# Altium schematic sheet 7-RES_CHECK.SchDoc: RD15002_SingleSCT.PrjPcb
size A4; DrawnBy: 邓勇杰; Revision: A1.0.0; SheetNumber: 8; SheetTotal: 10; Time: 2015/12/2
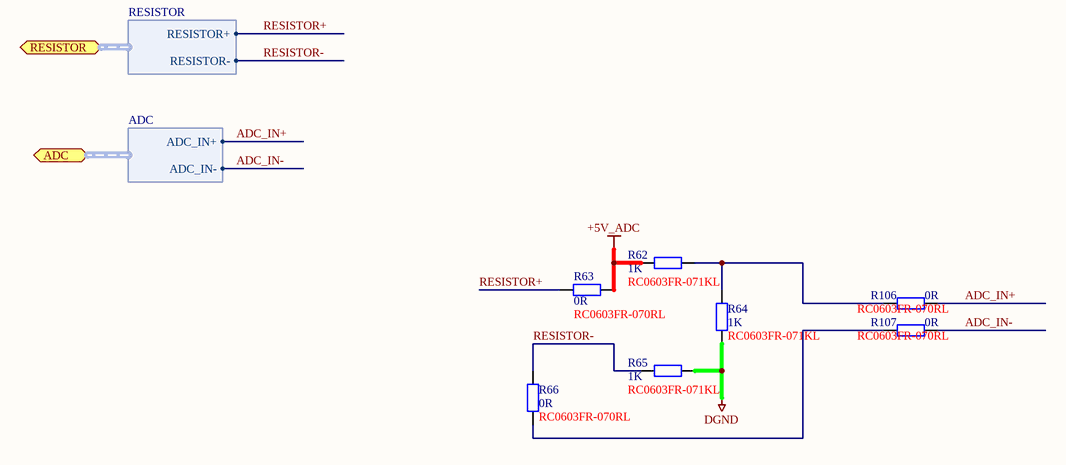
[diagram p0: 7-RES_CHECK.SchDoc]

## Parts
R62  1K  Type No.: RC0603FR-071KL  [CC0603]
R63  0R  Type No.: RC0603FR-070RL  [CC0603]
R64  1K  Type No.: RC0603FR-071KL  [CC0603]
R65  1K  Type No.: RC0603FR-071KL  [CC0603]
R66  0R  Type No.: RC0603FR-070RL  [CC0603]
R106  0R  Type No.: RC0603FR-070RL  [CC0603]
R107  0R  Type No.: RC0603FR-070RL  [CC0603]

## Ports
ADC (harness ADC), RESISTOR (harness RESISTOR)

## Harnesses
RESISTOR: RESISTOR+, RESISTOR-
ADC: ADC_IN+, ADC_IN-

## Nets
+5V_ADC: R62.2 R63.2
DGND: R64.2 R65.1
ADC_IN+: R106.1 ; port ADC.ADC_IN+
ADC_IN-: R107.1 ; port ADC.ADC_IN-
RESISTOR+: R63.1 ; port RESISTOR.RESISTOR+
RESISTOR-: R65.2 R66.1 ; port RESISTOR.RESISTOR-
NetR62_1: R62.1 R64.1 R106.2
NetR66_2: R66.2 R107.2

## Notes on the sheet
- 文件版本:
- 原理图名:
- 工 程  名:
- 绘       制:
- 审       核:
- 第   页，共    页
- 日       期:

## Library data of the parts
R62-R66 R106 R107 = Res2: Resistor